# Altium schematic sheet P15_ETH3(USB)_USB 2.0 HUB.SchDoc
size 420 x 297 mm
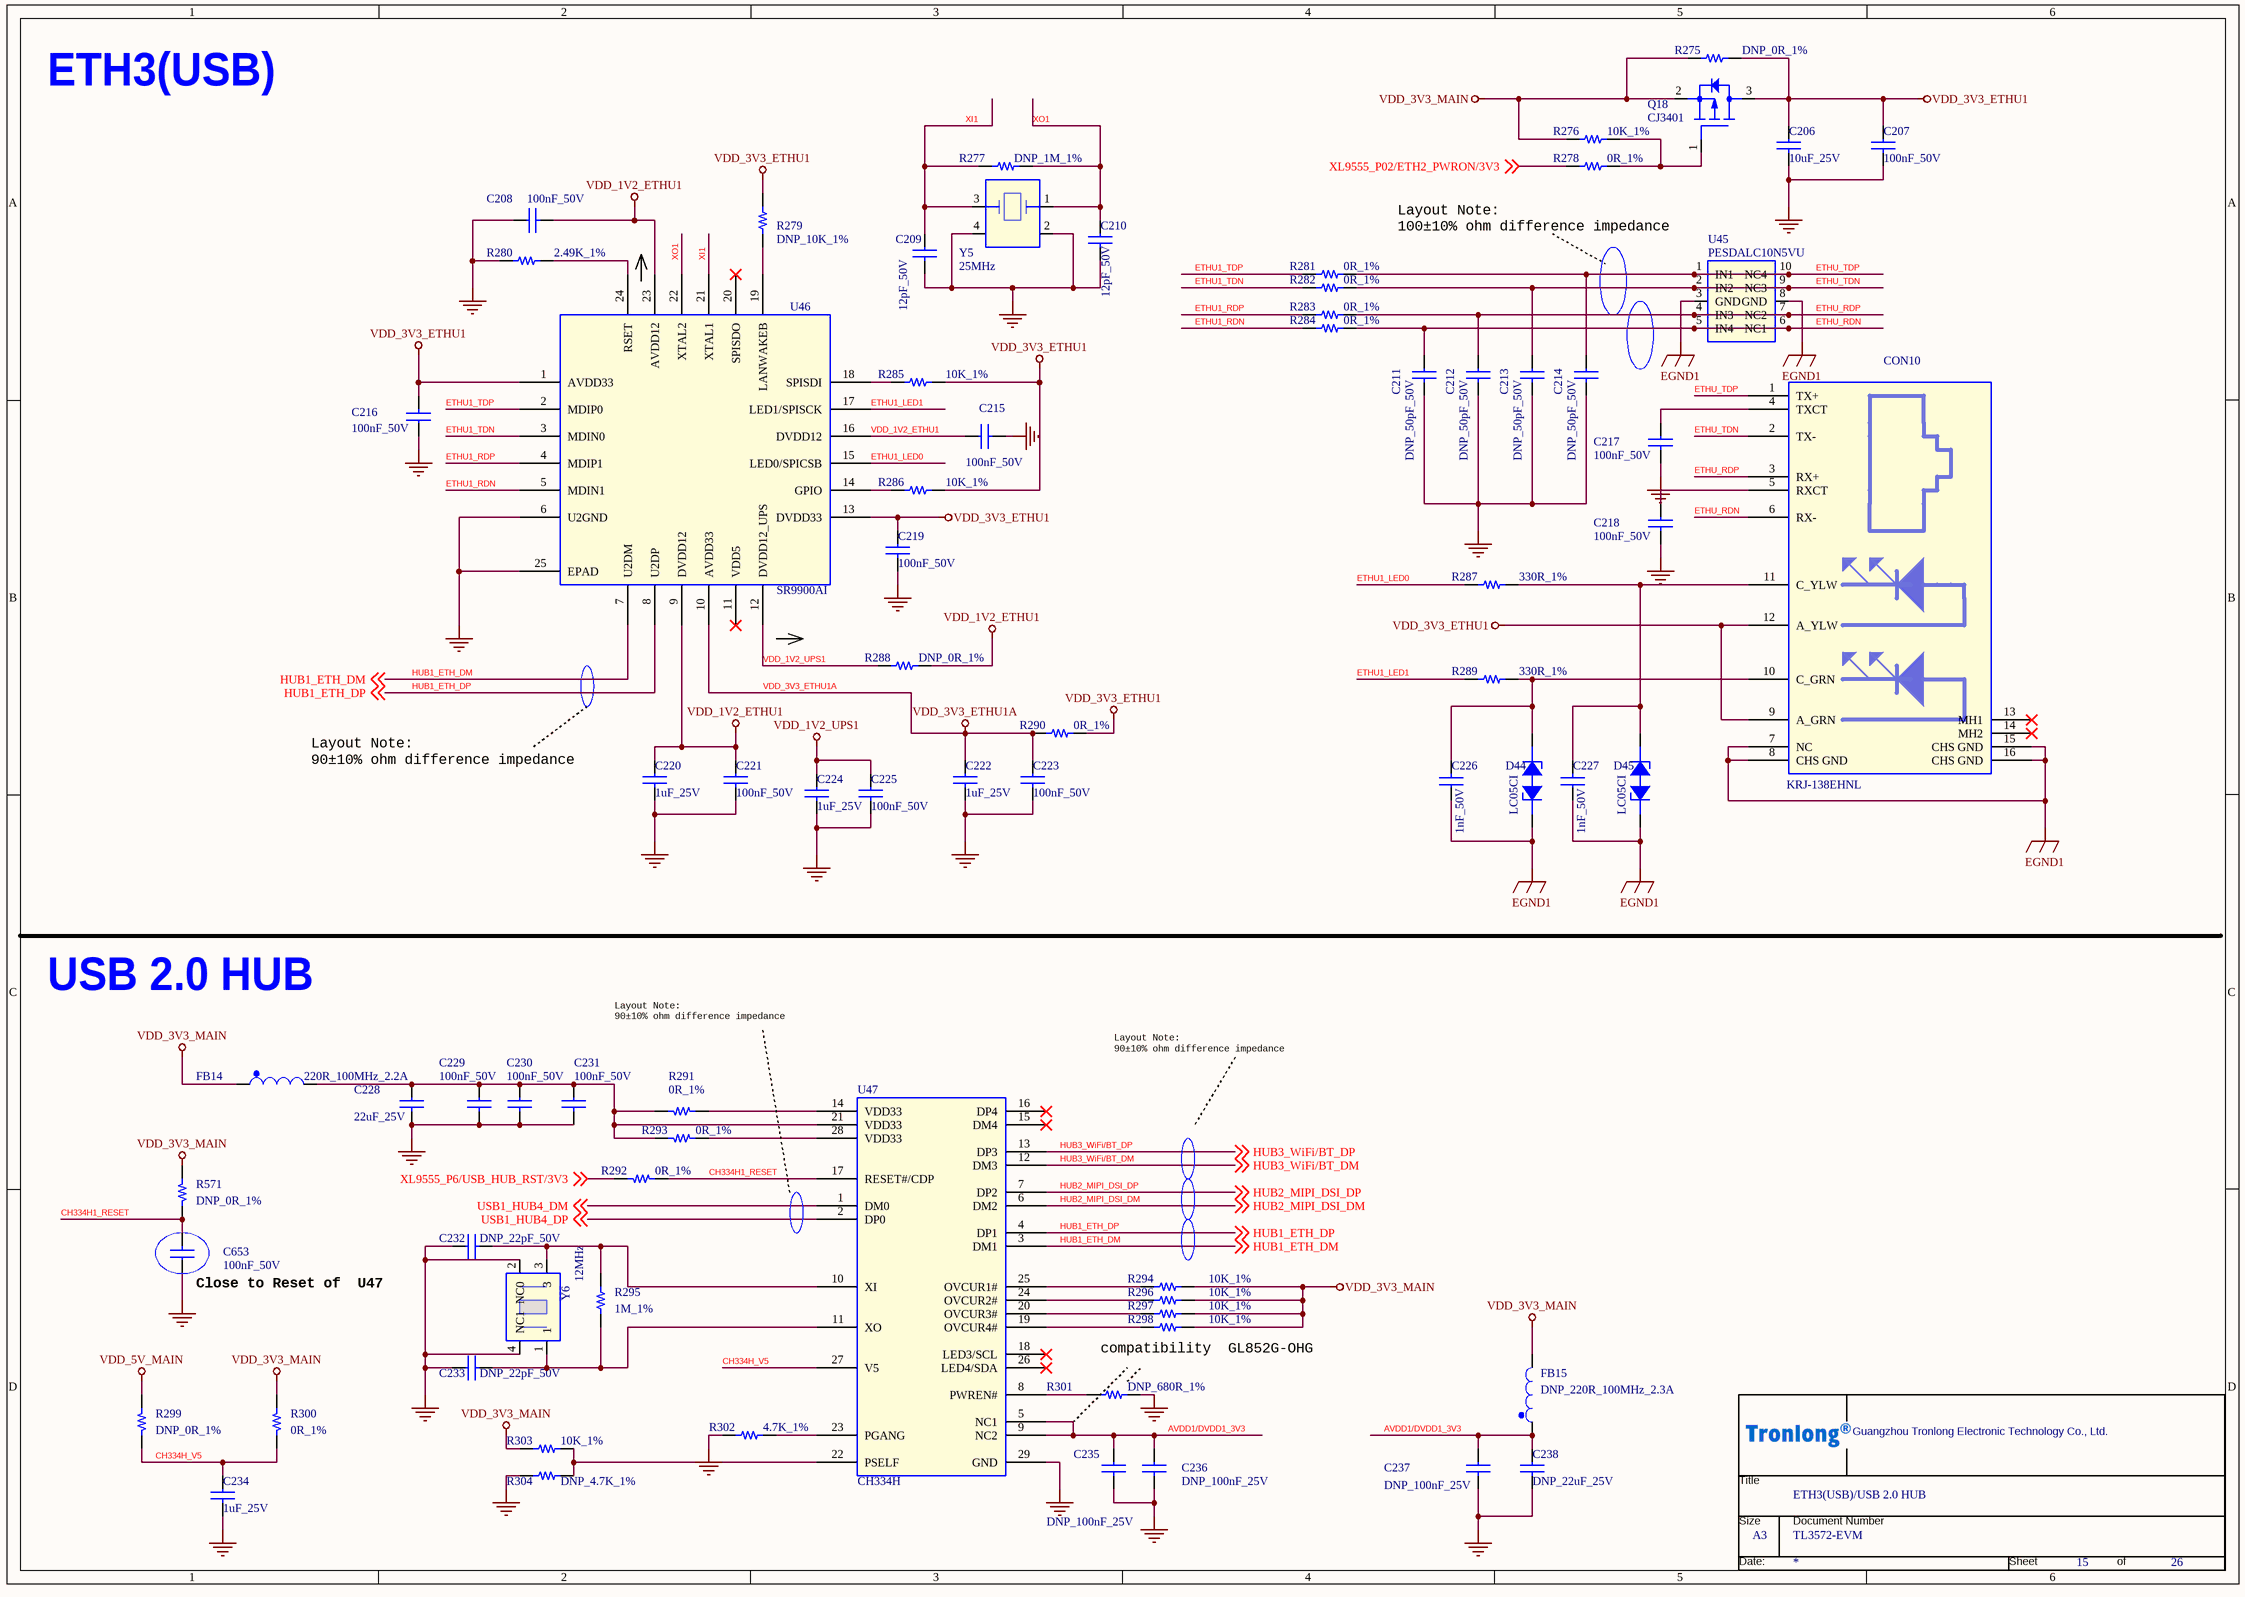
[diagram p0: P15_ETH3(USB)_USB 2.0 HUB.SchDoc]

## Parts
*  Doc: TL3572-EVM  Title: ETH3(USB)/USB 2.0 HUB  OrgName: Guangzhou Tronlong Electronic Technology Co., Ltd.  Page Size: A3  Page Number: 15  Page Count: 26  (hidden comment: Tronlong_TITTLE_20211115)  (graphical)
C206  10uF_25V  [C0603]
C207  100nF_50V  [C0402]
C208  100nF_50V  [C0402]
C209  12pF_50V  [C0402]
C210  12pF_50V  [C0402]
C211  DNP_50pF_50V  [C0402]
C212  DNP_50pF_50V  [C0402]
C213  DNP_50pF_50V  [C0402]
C214  DNP_50pF_50V  [C0402]
C215  100nF_50V  [C0402]
C216  100nF_50V  [C0402]
C217  100nF_50V  [C0402]
C218  100nF_50V  [C0402]
C219  100nF_50V  [C0402]
C220  1uF_25V  [C0402]
C221  100nF_50V  [C0402]
C222  1uF_25V  [C0402]
C223  100nF_50V  [C0402]
C224  1uF_25V  [C0402]
C225  100nF_50V  [C0402]
C226  1nF_50V  [C0402]
C227  1nF_50V  [C0402]
C228  22uF_25V  [C0805]
C229  100nF_50V  [C0402]
C230  100nF_50V  [C0402]
C231  100nF_50V  [C0402]
C232  DNP_22pF_50V  [C0603]
C233  DNP_22pF_50V  [C0603]
C234  1uF_25V  [C0402]
C235  DNP_100nF_25V  [C0402]
C236  DNP_100nF_25V  [C0402]
C237  DNP_100nF_25V  [C0402]
C238  DNP_22uF_25V  [C0805]
C653  100nF_50V  [C0402]
CON10  KRJ-138EHNL  [CON_YDS_13F-64GYD2PLXNL]
D44  LC05CI  [SOD323]
D45  LC05CI  [SOD323]
FB14  220R_100MHz_2.2A  [L0603]
FB15  DNP_220R_100MHz_2.3A  [L0603]
Q18  CJ3401  [SOT23-3]
R275  DNP_0R_1%  [R0603]
R276  10K_1%  [R0402]
R277  DNP_1M_1%  [R0603]
R278  0R_1%  [R0402]
R279  DNP_10K_1%  [R0402]
R280  2.49K_1%  [R0603]
R281  0R_1%  [R0402]
R282  0R_1%  [R0402]
R283  0R_1%  [R0402]
R284  0R_1%  [R0402]
R285  10K_1%  [R0402]
R286  10K_1%  [R0402]
R287  330R_1%  [R0402]
R288  DNP_0R_1%  [R0603]
R289  330R_1%  [R0402]
R290  0R_1%  [R0603]
R291  0R_1%  [R0402]
R292  0R_1%  [R0402]
R293  0R_1%  [R0402]
R294  10K_1%  [R0402]
R295  1M_1%  [R0402]
R296  10K_1%  [R0402]
R297  10K_1%  [R0402]
R298  10K_1%  [R0402]
R299  DNP_0R_1%  [R0402]
R300  0R_1%  [R0603]
R301  DNP_680R_1%  [R0603]
R302  4.7K_1%  [R0402]
R303  10K_1%  [R0402]
R304  DNP_4.7K_1%  [R0402]
R571  DNP_0R_1%  [R0402]
U45  PESDALC10N5VU  [DFN-10-2510]
U46  SR9900AI  [QFN24-4X4-0d5]
U47  CH334H  [QFN28_5x5]
Y5  25MHz  [SMD_3225]
Y6  12MHz  [SMD_3225]

## Nets
EGND1: C226.1 C227.1 CON10.7(NC) CON10.8(CHS_GND) CON10.15(CHS_GND) CON10.16(CHS_GND) D44.1(ANODE1) D45.1(ANODE1) U45.3(GND) U45.8(GND)
GND: C206.2 C207.2 C208.1 C209.2 C210.2 C211.2 C212.2 C213.2 C214.2 C215.2 C216.1 C217.2 C218.2 C219.2 C220.2 C221.2 C222.2 C223.2 C224.2 C225.2 C228.2 C229.2 C230.2 C231.2 C232.1 C233.1 C234.2 C235.2 C236.2 C237.2 C238.2 C653.1 R280.1 R301.2 R302.2 R304.2 U46.6(U2GND) U46.25(EPAD) U47.29(GND) Y5.2 Y5.4 Y6.2(NC0) Y6.4(NC1)
VDD_1V2_ETHU1: C208.2 C215.1 C220.1 C221.1 R288.2 U46.9(DVDD12) U46.16(DVDD12) U46.23(AVDD12)
VDD_1V2_UPS1: C224.1 C225.1 R288.1 U46.12(DVDD12_UPS)
VDD_3V3_ETHU1: C206.1 C207.1 C216.2 C219.1 CON10.9(A_GRN) CON10.12(A_YLW) Q18.3(DRAIN) R275.2 R279.2 R285.2 R286.2 R290.2 U46.1(AVDD33) U46.13(DVDD33)
VDD_3V3_ETHU1A: C222.1 C223.1 R290.1 U46.10(AVDD33)
VDD_3V3_MAIN: FB14.1 FB15.2 Q18.2(SOURCE) R275.1 R276.1 R294.2 R296.2 R297.2 R298.2 R300.2 R303.1 R571.2
VDD_5V_MAIN: R299.2
AVDD1/DVDD1_3V3: C235.1 C236.1 C237.1 C238.1 FB15.1 U47.5(NC1) U47.9(NC2)
CH334H1_RESET: C653.2 R292.1 R571.1 U47.17(RESET#/CDP)
CH334H_V5: C234.1 R299.1 R300.1 U47.27(V5)
ETHU1_LED0: R287.1 U46.15(LED0/SPICSB)
ETHU1_LED1: R289.1 U46.17(LED1/SPISCK)
ETHU1_RDN: R284.2 U46.5(MDIN1)
ETHU1_RDP: R283.2 U46.4(MDIP1)
ETHU1_TDN: R282.2 U46.3(MDIN0)
ETHU1_TDP: R281.2 U46.2(MDIP0)
ETHU_RDN: C211.1 CON10.6(RX-) R284.1 U45.5(IN4) U45.6(NC1)
ETHU_RDP: C212.1 CON10.3(RX+) R283.1 U45.4(IN3) U45.7(NC2)
ETHU_TDN: C213.1 CON10.2(TX-) R282.1 U45.2(IN2) U45.9(NC3)
ETHU_TDP: C214.1 CON10.1(TX+) R281.1 U45.1(IN1) U45.10(NC4)
HUB1_ETH_DM: U46.7(U2DM) U47.3(DM1) ; off-sheet HUB1_ETH_DM
HUB1_ETH_DP: U46.8(U2DP) U47.4(DP1) ; off-sheet HUB1_ETH_DP
HUB2_MIPI_DSI_DM: U47.6(DM2) ; off-sheet HUB2_MIPI_DSI_DM
HUB2_MIPI_DSI_DP: U47.7(DP2) ; off-sheet HUB2_MIPI_DSI_DP
HUB3_WiFi/BT_DM: U47.12(DM3) ; off-sheet HUB3_WiFi/BT_DM
HUB3_WiFi/BT_DP: U47.13(DP3) ; off-sheet HUB3_WiFi/BT_DP
USB1_HUB4_DM: U47.1(DM0) ; off-sheet USB1_HUB4_DM
USB1_HUB4_DP: U47.2(DP0) ; off-sheet USB1_HUB4_DP
XI1: C209.1 R277.2 U46.21(XTAL1) Y5.3
XL9555_P02/ETH2_PWRON/3V3: R278.2 ; off-sheet XL9555_P02/ETH2_PWRON/3V3
XL9555_P6/USB_HUB_RST/3V3: R292.2 ; off-sheet XL9555_P6/USB_HUB_RST/3V3
XO1: C210.1 R277.1 U46.22(XTAL2) Y5.1
NetC217_1: C217.1 CON10.4(TXCT)
NetC218_1: C218.1 CON10.5(RXCT)
NetC226_2: C226.2 CON10.10(C_GRN) D44.2(CATHODE2) R289.2
NetC227_2: C227.2 CON10.11(C_YLW) D45.2(CATHODE2) R287.2
NetC228_1: C228.1 C229.1 C230.1 C231.1 FB14.2 R291.1 R293.1 U47.21(VDD33)
NetC232_2: C232.2 R295.1 U47.10(XI) Y6.3
NetC233_2: C233.2 R295.2 U47.11(XO) Y6.1
NetQ18_1: Q18.1(GATE) R276.2 R278.1
NetR279_1: R279.1 U46.19(LANWAKEB)
NetR280_2: R280.2 U46.24(RSET)
NetR285_1: R285.1 U46.18(SPISDI)
NetR286_1: R286.1 U46.14(GPIO)
NetR291_2: R291.2 U47.14(VDD33)
NetR293_2: R293.2 U47.28(VDD33)
NetR294_1: R294.1 U47.25(OVCUR1#)
NetR296_1: R296.1 U47.24(OVCUR2#)
NetR297_1: R297.1 U47.20(OVCUR3#)
NetR298_1: R298.1 U47.19(OVCUR4#)
NetR301_1: R301.1 U47.8(PWREN#)
NetR302_1: R302.1 U47.23(PGANG)
NetR303_2: R303.2 R304.1 U47.22(PSELF)

Not connected (* = marked no-connect by the designer): CON10 13(MH1)* 14(MH2)*; U46 11(VDD5)* 20(SPISDO)*; U47 15(DM4)* 16(DP4)* 18(LED3/SCL)* 26(LED4/SDA)*

## Notes on the sheet
- ETH3(USB)
- Layout Note:
  100±10% ohm difference impedance
- (near C220) Layout Note:
  90±10% ohm difference impedance
- USB 2.0 HUB
- Layout Note:
  90±10% ohm difference impedance
- (near C653) Close to Reset of  U47
- (near R298) compatibility  GL852G-OHG
- (in symbol Tronlong_TITTLE_20211115) Title; Size; Document Number; Date:; Sheet; of

## Library data of the parts
* = Tronlong_TITTLE_20211115: RevCode: A?; Page Create Date: March  8, 1995; Page Modify Date: *
C206 = CAP NP_Dup2: 贴片陶瓷电容,10uF,20%,25V,X5R; Manufacturer: 广东风华高新科技股份有限公司（FH）; Manufacturer PartNumber: 0603X106M250NT; Manufacturer Character: 中国大陆; Eco-Label: ROHS; ERP Number: 005.0001.0001.00527; As-Welded: /; Operation Temperature（℃）: -55~+85(Ta); room: RGMII1; Part Status: 优选; Temperature: -55~125℃; PCB Footprint: C0603
C207 C219 C223 = CAP NP_Dup2: 贴片陶瓷电容,100nF,10%,50V,X7R; Manufacturer Character: 中国大陆; Manufacturer: 广东风华高新科技股份有限公司（FH）; Manufacturer PartNumber: 0402B104K500NT; As-Welded: /; room: RGMII1; Operation Temperature（℃）: -55~+125(Ta); ERP Number: 005.0001.0001.00681; Eco-Label: ROHS; Temperature: -55~125℃; Part Status: 试用; PCB Footprint: C0402
C208 C216 = CAP NP_Dup2: 贴片陶瓷电容,100nF,10%,50V,X7R; Manufacturer Character: 中国大陆; Manufacturer: 广东风华高新科技股份有限公司（FH）; Manufacturer PartNumber: 0402B104K500NT; Eco-Label: ROHS; ERP Number: 005.0001.0001.00681; room: RGMII1; Operation Temperature（℃）: -55~+125(Ta); As-Welded: /; Part Status: 试用; Temperature: -55~125℃; PCB Footprint: C0402
C209 = CAP NP_Dup2: 贴片陶瓷电容,12pF,5%,50V,COG; Manufacturer Character: 中国大陆; Manufacturer: 广东风华高新科技股份有限公司（FH）; Manufacturer PartNumber: 0402CG120J500NT; ERP Number: 005.0001.0001.00612; As-Welded: /; room: RGMII1; Operation Temperature（℃）: -55~+125(Ta); Eco-Label: ROHS; Part Status: 试用; Temperature: -55~125℃; PCB Footprint: C0402
C210 = CAP NP_Dup2: 贴片陶瓷电容,12pF,5%,50V,COG; Manufacturer Character: 中国大陆; Manufacturer PartNumber: 0402CG120J500NT; Manufacturer: 广东风华高新科技股份有限公司（FH）; ERP Number: 005.0001.0001.00612; As-Welded: /; room: RGMII1; Operation Temperature（℃）: -55~+125(Ta); Eco-Label: ROHS; Part Status: 试用; Temperature: -55~125℃; PCB Footprint: C0402
C211-C214 = CAP NP_Dup2: 贴片陶瓷电容,100nF,10%,50V,X7R; Manufacturer Character: 中国大陆; Manufacturer: 广东风华高新科技股份有限公司（FH）; Manufacturer PartNumber: 0402B104K500NT; As-Welded: DNP; room: 6; Operation Temperature（℃）: -55~+125(Ta); ERP Number: 005.0001.0001.00681; Eco-Label: ROHS; Temperature: -55~125℃; Part Status: 试用; PCB Footprint: C0402
C215 C225 = CAP NP_Dup2: 贴片陶瓷电容,100nF,10%,50V,X7R; Manufacturer Character: 中国大陆; Manufacturer PartNumber: 0402B104K500NT; Manufacturer: 广东风华高新科技股份有限公司（FH）; As-Welded: /; room: RGMII1; Operation Temperature（℃）: -55~+125(Ta); ERP Number: 005.0001.0001.00681; Eco-Label: ROHS; Part Status: 试用; Temperature: -55~125℃; PCB Footprint: C0402
C217 = CAP NP_Dup2: 贴片陶瓷电容,100nF,10%,50V,X7R; Manufacturer Character: 中国大陆; Manufacturer: 广东风华高新科技股份有限公司（FH）; Manufacturer PartNumber: 0402B104K500NT; As-Welded: /; room: 6; Operation Temperature（℃）: -55~+125(Ta); ERP Number: 005.0001.0001.00681; Eco-Label: ROHS; Temperature: -55~125℃; Part Status: 试用; PCB Footprint: C0402
C218 = CAP NP_Dup2: 贴片陶瓷电容,100nF,10%,50V,X7R; Manufacturer PartNumber: 0402B104K500NT; Manufacturer: 广东风华高新科技股份有限公司（FH）; Manufacturer Character: 中国大陆; As-Welded: /; Operation Temperature（℃）: -55~+125(Ta); room: 6; ERP Number: 005.0001.0001.00681; Eco-Label: ROHS; Temperature: -55~125℃; Part Status: 试用; PCB Footprint: C0402
C220 C224 = CAP NP_Dup2: 贴片陶瓷电容,1uF,10%,25V,X5R; Manufacturer Character: 中国大陆; Manufacturer: 广东风华高新科技股份有限公司（FH）; Manufacturer PartNumber: 0402X105K250NT; Eco-Label: ROHS; ERP Number: 005.0001.0001.00640; Operation Temperature（℃）: -55~+85(Ta); room: RGMII1; As-Welded: /; Part Status: 试用; PCB Footprint: C0402
C221 = CAP NP_Dup2: 贴片陶瓷电容,100nF,10%,50V,X7R; Manufacturer PartNumber: 0402B104K500NT; Manufacturer: 广东风华高新科技股份有限公司（FH）; Manufacturer Character: 中国大陆; As-Welded: /; Operation Temperature（℃）: -55~+125(Ta); room: RGMII1; ERP Number: 005.0001.0001.00681; Eco-Label: ROHS; Part Status: 试用; Temperature: -55~125℃; PCB Footprint: C0402
C222 = CAP NP_Dup2: 贴片陶瓷电容,1uF,10%,25V,X5R; Manufacturer: 广东风华高新科技股份有限公司（FH）; Manufacturer PartNumber: 0402X105K250NT; Manufacturer Character: 中国大陆; Eco-Label: ROHS; ERP Number: 005.0001.0001.00640; room: RGMII1; Operation Temperature（℃）: -55~+85(Ta); As-Welded: /; Part Status: 试用; PCB Footprint: C0402
C226 = CAP NP_1: 贴片陶瓷电容,1nF,10%,50V,X7R; Manufacturer: 广东风华高新科技股份有限公司（FH）; Manufacturer PN: GRM033R61E102KA01; Manufacturer Character: 中国大陆; Manufacturer PartNumber: 0402B102K500NT; ERP Number: 005.0001.0001.00523; RK PN: 902003109; Priority: A; Operation Temperature（℃）: -55~+125(Ta); As-Welded: /; Eco-Label: ROHS; Part Type: 一般用片状陶瓷电容; Tolerance: ±10%; Created by: JJJ; Part Status: 优选
C227 = CAP NP_1: 贴片陶瓷电容,1nF,10%,50V,X7R; Manufacturer PartNumber: 0402B102K500NT; Manufacturer Character: 中国大陆; Manufacturer PN: GRM033R61E102KA01; Manufacturer: 广东风华高新科技股份有限公司（FH）; As-Welded: /; Operation Temperature（℃）: -55~+125(Ta); Priority: A; RK PN: 902003109; ERP Number: 005.0001.0001.00523; Eco-Label: ROHS; Created by: JJJ; Tolerance: ±10%; Part Type: 一般用片状陶瓷电容; Part Status: 优选
C228 = CAP NP_Dup2: 贴片陶瓷电容,22uF,20%,25V,X5R; Manufacturer Character: 中国大陆; Manufacturer PartNumber: 0805X226M250NT; Manufacturer: 广东风华高新科技股份有限公司（FH）; room: USB HUB; Operation Temperature（℃）: -55~+85(Ta); As-Welded: /; ERP Number: 005.0001.0001.00524; Eco-Label: ROHS; Temperature: -55~125℃; Part Status: 优选; PCB Footprint: C0805
C229 C231 = CAP NP_Dup2: 贴片陶瓷电容,100nF,10%,50V,X7R; Manufacturer PartNumber: 0402B104K500NT; Manufacturer: 广东风华高新科技股份有限公司（FH）; Manufacturer Character: 中国大陆; As-Welded: /; Operation Temperature（℃）: -55~+125(Ta); room: USB HUB; ERP Number: 005.0001.0001.00681; Eco-Label: ROHS; Temperature: -55~125℃; Part Status: 试用; PCB Footprint: C0402
C230 = CAP NP_Dup2: 贴片陶瓷电容,100nF,10%,50V,X7R; Manufacturer Character: 中国大陆; Manufacturer PartNumber: 0402B104K500NT; Manufacturer: 广东风华高新科技股份有限公司（FH）; As-Welded: /; room: USB HUB; Operation Temperature（℃）: -55~+125(Ta); ERP Number: 005.0001.0001.00681; Eco-Label: ROHS; Temperature: -55~125℃; Part Status: 试用; PCB Footprint: C0402
C232 = CAP NP_Dup2: 贴片陶瓷电容,22pF,5%,50V,COG; Manufacturer PartNumber: 0603CG220J500NT; Manufacturer: 广东风华高新科技股份有限公司（FH）; Manufacturer Character: 中国大陆; Eco-Label: EXEMPTION; ERP Number: 005.0001.0001.00542; Operation Temperature（℃）: -55~+125(Ta); As-Welded: DNP; room: USB HUB; Part Status: 优选; Temperature: -55~125℃; PCB Footprint: C0603
C233 = CAP NP_Dup2: 贴片陶瓷电容,22pF,5%,50V,COG; Manufacturer: 广东风华高新科技股份有限公司（FH）; Manufacturer PartNumber: 0603CG220J500NT; Manufacturer Character: 中国大陆; Eco-Label: EXEMPTION; ERP Number: 005.0001.0001.00542; Operation Temperature（℃）: -55~+125(Ta); As-Welded: DNP; room: USB HUB; Part Status: 优选; Temperature: -55~125℃; PCB Footprint: C0603
C234 = CAP NP_Dup2: 贴片陶瓷电容,1uF,10%,25V,X5R; Manufacturer: 广东风华高新科技股份有限公司（FH）; Manufacturer PartNumber: 0402X105K250NT; Manufacturer Character: 中国大陆; Eco-Label: ROHS; ERP Number: 005.0001.0001.00640; room: USB HUB; Operation Temperature（℃）: -55~+85(Ta); As-Welded: /; PCB Footprint: C0402; Part Status: 试用
C235 = CAP NP_Dup2: 贴片陶瓷电容,100nF,10%,25V,X7R; Manufacturer Character: 中国大陆; Manufacturer PartNumber: 0402B104K250NT; Manufacturer: 广东风华高新科技股份有限公司（FH）; room: USB HUB; As-Welded: DNP; Operation Temperature（℃）: -55~+125(Ta); ERP Number: 005.0001.0001.00518; Eco-Label: ROHS; Part Status: 优选; Temperature: -55~125℃; PCB Footprint: C0402
C236 = CAP NP_Dup2: 贴片陶瓷电容,100nF,10%,25V,X7R; Manufacturer Character: 中国大陆; Manufacturer PartNumber: 0402B104K250NT; Manufacturer: 广东风华高新科技股份有限公司（FH）; Eco-Label: ROHS; ERP Number: 005.0001.0001.00518; room: USB HUB; As-Welded: DNP; Operation Temperature（℃）: -55~+125(Ta); Part Status: 优选; Temperature: -55~125℃; PCB Footprint: C0402
C237 = CAP NP_Dup2: 贴片陶瓷电容,100nF,10%,25V,X7R; Manufacturer: 广东风华高新科技股份有限公司（FH）; Manufacturer PartNumber: 0402B104K250NT; Manufacturer Character: 中国大陆; Eco-Label: ROHS; ERP Number: 005.0001.0001.00518; Operation Temperature（℃）: -55~+125(Ta); As-Welded: DNP; room: USB HUB; Part Status: 优选; Temperature: -55~125℃; PCB Footprint: C0402
C238 = CAP NP_Dup2: CL21A226MAQNNNE，CL21A226MAYNNNE; Manufacturer PartNumber: 22uF,20%,C0805,25V,（X7R,X5R,COG,NPO或X7S）; Manufacturer: 广州创龙; Operation Temperature（℃）: -40~+85(Ta); As-Welded: DNP; room: USB HUB; ERP Number: 005.0001.0022.00185; Eco-Label: ROHS; Part Status: -; Temperature: -55~125℃; Manufacturer Character: -; PCB Footprint: C0805
C653 = CAP NP_Dup2: 贴片陶瓷电容,100nF,10%,50V,X7R; Manufacturer: 广东风华高新科技股份有限公司（FH）; Manufacturer PartNumber: 0402B104K500NT; Manufacturer Character: 中国大陆; Eco-Label: ROHS; Operation Temperature（℃）: -55~+125(Ta); room: USB HUB; As-Welded: /; ERP Number: 005.0001.0001.00681; Temperature: -55~125℃; Part Status: 试用; PCB Footprint: C0402
CON10 = ETHERNET CONNECTER: RJ45连接器,12P,2.54mm间距,单层母座,90度,插件; Manufacturer Character: 中国大陆; Manufacturer: 东莞市科优达电子科技有限公司（DGKYD）; room: ecat1; Operation Temperature（℃）: -40~+85(Ta); As-Welded: /; ERP Number: 005.0001.0003.00314; Eco-Label: ROHS; Manufacturer PartNumber: KRJ-138EHNL; Manufacturer Part Number: KRJ-138EHNL; Temperature: -40~85℃; Part Status: 优选; PCB Footprint: CON_YDS_13F-64GYD2PLXNL
D44 D45 = DIODE BREAKDOWN_2: TVS二极管,VRWM=5V,VBR=6V,一组,双向,30KV,30KV; Manufacturer Character: 中国大陆; Manufacturer: 上海雷卯电子科技有限公司（Leiditech）; Manufacturer Part Number: PESD3V3L1BA; Eco-Label: ROHS; ERP Number: 005.0001.0017.00060; room: KEY; Operation Temperature（℃）: -55~+125(Tj); As-Welded: /; Manufacturer PartNumber: LC05CI; Temperature: -55~155℃; Part Status: 优选; PCB Footprint: SOD323
FB14 = FERRITE BEAD: 磁珠,50mΩ,2.2A,220R@100MHz; Manufacturer PartNumber: UPZ1608U221-2R2TF; Manufacturer: 深圳顺络电子股份有限公司（Sunlord）; Manufacturer Character: 中国大陆; Eco-Label: ROHS; ERP Number: 005.0001.0007.00015; As-Welded: /; Operation Temperature（℃）: -55~+125(Ta); room: USB HUB; Temperature: -55~+125(Ta); Part Status: 限选; PCB Footprint: L0603
FB15 = FERRITE BEAD: 磁珠,50mΩ,2.3A,220R@100MHz; Manufacturer PartNumber: UPZ1608U221-2R3TF; Manufacturer: 深圳顺络电子股份有限公司（Sunlord）; Manufacturer Character: 中国大陆; Operation Temperature（℃）: -55~+125(Ta); As-Welded: DNP; room: USB HUB; ERP Number: 005.0001.0007.00023; Eco-Label: ROHS; Temperature: -55~125℃; Part Status: 测评; PCB Footprint: L0603
Q18 = MOSFET P SOT: MOSFET,P沟道,VDSS=-30V,VGSS=±12V,ID=-4.2A,PD=0.35W,VGS(th)=-1.3V; Manufacturer Character: 中国大陆; Manufacturer: 江苏长晶科技股份有限公司（JSCJ）; Eco-Label: ROHS; ERP Number: 005.0001.0009.00015; As-Welded: /; Operation Temperature（℃）: -55~+150(Tj); room: DCIN; Manufacturer PartNumber: CJ3401; Manufacturer Part Number: CJ3401; Temperature: -55~150℃; Part Status: 优选; PCB Footprint: SOT23-3
R275 = Resistor_Dup3: 贴片电阻,0R,±1%,1/10W; Manufacturer Character: 中国大陆; Manufacturer PartNumber: RS-03000FT; Manufacturer: 广东风华高新科技股份有限公司（FH）; CLASS: DISCRETE; As-Welded: DNP; room: RGMII1; Operation Temperature（℃）: -55~+155(Ta); ERP Number: 005.0001.0002.00956; Eco-Label: ROHS; Part Status: 优选; Temperature: -55~125℃; PCB Footprint: R0603
R276 = Resistor_Dup3: 贴片电阻,10K,±1%,1/16W; Manufacturer: 广东风华高新科技股份有限公司（FH）; Manufacturer PartNumber: RC-02K1002FT; Manufacturer Character: 中国大陆; CLASS: DISCRETE; Eco-Label: ROHS; ERP Number: 005.0001.0002.01326; As-Welded: /; Operation Temperature（℃）: -55~+125(Ta); Temperature: –55~155℃; Part Status: 优选; PCB Footprint: R0402
R277 = Resistor_Dup3: 0603WAF1004T5E,RC0603FR-071ML; Manufacturer: 广州创龙; Manufacturer PartNumber: 1M,±1%,R0603,≥1/10W; CLASS: DISCRETE; room: RGMII1; As-Welded: DNP; Operation Temperature（℃）: -40~+85(Ta); ERP Number: 005.0001.0023.00339; Eco-Label: ROHS; Part Status: -; Manufacturer Character: -; PCB Footprint: R0603
R278 = Resistor_Dup3: 贴片电阻,0R,±1%,1/16W; Manufacturer Character: 中国大陆; Manufacturer PartNumber: RC-02000FT; Manufacturer: 广东风华高新科技股份有限公司（FH）; CLASS: DISCRETE; Eco-Label: ROHS; ERP Number: 005.0001.0002.00938; Operation Temperature（℃）: -55~+155(Ta); As-Welded: /; Part Status: 优选; PCB Footprint: R0402
R279 = Resistor_Dup3: 贴片电阻,10K,±1%,1/16W; Manufacturer PartNumber: RC-02K1002FT; Manufacturer: 广东风华高新科技股份有限公司（FH）; Manufacturer Character: 中国大陆; CLASS: DISCRETE; Operation Temperature（℃）: -55~+125(Ta); As-Welded: DNP; room: RGMII1; ERP Number: 005.0001.0002.01326; Eco-Label: ROHS; Part Status: 优选; Temperature: -55~125℃; PCB Footprint: R0402
R280 = Resistor_Dup3: 贴片电阻,2.49K,±1%,1/10W; Manufacturer PartNumber: RS-03K2491FT; Manufacturer: 广东风华高新科技股份有限公司（FH）; Manufacturer Character: 中国大陆; CLASS: DISCRETE; Eco-Label: ROHS; ERP Number: 005.0001.0002.00969; Operation Temperature（℃）: -55~+155(Ta); room: RGMII1; As-Welded: /; Part Status: 优选; PCB Footprint: R0603
R281-R284 R292 = Resistor_Dup3: 贴片电阻,0R,±1%,1/16W; Manufacturer: 广东风华高新科技股份有限公司（FH）; Manufacturer PartNumber: RC-02000FT; Manufacturer Character: 中国大陆; CLASS: DISCRETE; Eco-Label: ROHS; ERP Number: 005.0001.0002.00938; Operation Temperature（℃）: -55~+155(Ta); As-Welded: /; Part Status: 优选; PCB Footprint: R0402
R285 = Resistor_Dup3: 贴片电阻,10K,±1%,1/16W; Manufacturer: 广东风华高新科技股份有限公司（FH）; Manufacturer PartNumber: RC-02K1002FT; Manufacturer Character: 中国大陆; CLASS: DISCRETE; Operation Temperature（℃）: -55~+125(Ta); room: RGMII1; As-Welded: /; ERP Number: 005.0001.0002.01326; Eco-Label: ROHS; Temperature: -55~125℃; Part Status: 优选; PCB Footprint: R0402
R286 = Resistor_Dup3: 贴片电阻,10K,±1%,1/16W; Manufacturer Character: 中国大陆; Manufacturer PartNumber: RC-02K1002FT; Manufacturer: 广东风华高新科技股份有限公司（FH）; CLASS: DISCRETE; Eco-Label: ROHS; ERP Number: 005.0001.0002.01326; As-Welded: /; room: RGMII1; Operation Temperature（℃）: -55~+125(Ta); Part Status: 优选; Temperature: -55~125℃; PCB Footprint: R0402
R287 = Resistor_Dup3: RC0402FR-07330RL,0402WGF3300TCE; Manufacturer PartNumber: 330R,±1%,R0402,≥1/16W; Manufacturer: 广州创龙; CLASS: DISCRETE; As-Welded: /; Operation Temperature（℃）: -40~+85(Ta); room: ecat1; ERP Number: 005.0001.0023.00144; Eco-Label: ROHS; Part Status: -; Temperature: –55~155℃; Manufacturer Character: -; PCB Footprint: R0402
R288 = Resistor_Dup3: 贴片电阻,0R,±1%,1/10W; Manufacturer Character: 中国大陆; Manufacturer PartNumber: RS-03000FT; Manufacturer: 广东风华高新科技股份有限公司（FH）; CLASS: DISCRETE; Eco-Label: ROHS; ERP Number: 005.0001.0002.00956; room: RGMII1; As-Welded: DNP; Operation Temperature（℃）: -55~+155(Ta); Temperature: -55~125℃; Part Status: 优选; PCB Footprint: R0603
R289 = Resistor_Dup3: RC0402FR-07330RL,0402WGF3300TCE; Manufacturer: 广州创龙; Manufacturer PartNumber: 330R,±1%,R0402,≥1/16W; CLASS: DISCRETE; As-Welded: /; Operation Temperature（℃）: -40~+85(Ta); room: ecat1; ERP Number: 005.0001.0023.00144; Eco-Label: ROHS; Part Status: -; Temperature: –55~155℃; Manufacturer Character: -; PCB Footprint: R0402
R290 = Resistor_Dup3: 贴片电阻,0R,±1%,1/10W; Manufacturer Character: 中国大陆; Manufacturer: 广东风华高新科技股份有限公司（FH）; Manufacturer PartNumber: RS-03000FT; CLASS: DISCRETE; Eco-Label: ROHS; ERP Number: 005.0001.0002.00956; As-Welded: /; Operation Temperature（℃）: -55~+155(Ta); room: RGMII1; Part Status: 优选; PCB Footprint: R0603
R291 R293 = Resistor_Dup3: 贴片电阻,0R,±1%,1/16W; Manufacturer Character: 中国大陆; Manufacturer: 广东风华高新科技股份有限公司（FH）; Manufacturer PartNumber: RC-02000FT; CLASS: DISCRETE; As-Welded: /; Operation Temperature（℃）: -55~+155(Ta); ERP Number: 005.0001.0002.00938; Eco-Label: ROHS; Part Status: 优选; PCB Footprint: R0402
R294 = Resistor_Dup3: 贴片电阻,10K,±1%,1/16W; Manufacturer Character: 中国大陆; Manufacturer: 广东风华高新科技股份有限公司（FH）; Manufacturer PartNumber: RC-02K1002FT; CLASS: DISCRETE; Eco-Label: ROHS; ERP Number: 005.0001.0002.01326; As-Welded: /; room: USB HUB; Operation Temperature（℃）: -55~+125(Ta); Temperature: –55~155℃; Part Status: 优选; PCB Footprint: R0402
R295 = Resistor_Dup3: RC0402FR-071ML,0402WGF1004TCE; Manufacturer PartNumber: 1M,±1%,R0402,≥1/16W; Manufacturer: 广州创龙; CLASS: DISCRETE; As-Welded: /; Operation Temperature（℃）: -40~+85(Ta); room: USB HUB; ERP Number: 005.0001.0023.00078; Eco-Label: ROHS; Part Status: -; Manufacturer Character: -; PCB Footprint: R0402
R296 R298 R303 = Resistor_Dup3: 贴片电阻,10K,±1%,1/16W; Manufacturer: 广东风华高新科技股份有限公司（FH）; Manufacturer PartNumber: RC-02K1002FT; Manufacturer Character: 中国大陆; CLASS: DISCRETE; Operation Temperature（℃）: -55~+125(Ta); room: USB HUB; As-Welded: /; ERP Number: 005.0001.0002.01326; Eco-Label: ROHS; Temperature: –55~155℃; Part Status: 优选; PCB Footprint: R0402
R297 = Resistor_Dup3: 贴片电阻,10K,±1%,1/16W; Manufacturer PartNumber: RC-02K1002FT; Manufacturer: 广东风华高新科技股份有限公司（FH）; Manufacturer Character: 中国大陆; CLASS: DISCRETE; Operation Temperature（℃）: -55~+125(Ta); room: USB HUB; As-Welded: /; ERP Number: 005.0001.0002.01326; Eco-Label: ROHS; Temperature: –55~155℃; Part Status: 优选; PCB Footprint: R0402
R299 = Resistor_Dup3: 贴片电阻,0R,±1%,1/16W; Manufacturer: 广东风华高新科技股份有限公司（FH）; Manufacturer PartNumber: RC-02000FT; Manufacturer Character: 中国大陆; CLASS: DISCRETE; Eco-Label: ROHS; ERP Number: 005.0001.0002.00938; As-Welded: DNP; Operation Temperature（℃）: -55~+155(Ta); PCB Footprint: R0402; Part Status: 优选
R300 = Resistor_Dup3: 贴片电阻,0R,±1%,1/10W; Manufacturer Character: 中国大陆; Manufacturer PartNumber: RS-03000FT; Manufacturer: 广东风华高新科技股份有限公司（FH）; CLASS: DISCRETE; As-Welded: /; Operation Temperature（℃）: -55~+155(Ta); ERP Number: 005.0001.0002.00956; Eco-Label: ROHS; Temperature: –55~155℃; Part Status: 优选; PCB Footprint: R0603
R301 = Resistor_Dup3: 贴片电阻,680R,±1%,1/10W; Manufacturer Character: 中国大陆; Manufacturer: 广东风华高新科技股份有限公司（FH）; Manufacturer PartNumber: RS-03K6800FT; CLASS: DISCRETE; Eco-Label: ROHS; ERP Number: 005.0001.0002.01053; room: USB HUB; As-Welded: DNP; Operation Temperature（℃）: -55~+155(Ta); PCB Footprint: R0603; Temperature: -55~155℃; Part Status: 优选
R302 = Resistor_Dup3: 贴片电阻,4.7K,±1%,1/16W; Manufacturer PartNumber: RC-02K4701FT; Manufacturer: 广东风华高新科技股份有限公司（FH）; Manufacturer Character: 中国大陆; CLASS: DISCRETE; Eco-Label: ROHS; ERP Number: 005.0001.0002.01359; Operation Temperature（℃）: -55~+125(Ta); As-Welded: /; Temperature: -55~155℃; Part Status: 试用; PCB Footprint: R0402
R304 = Resistor_Dup3: RC0402FR-074K7L,0402WGF4701TCE; Manufacturer: 广州创龙; Manufacturer PartNumber: 4.7K,±1%,R0402,≥1/16W; CLASS: DISCRETE; ERP Number: 005.0001.0023.00160; As-Welded: DNP; Operation Temperature（℃）: -40~+85(Ta); Eco-Label: ROHS; PCB Footprint: R0402; Temperature: -55~155℃; Manufacturer Character: -; Part Status: -
R571 = Resistor_Dup3: 贴片电阻,0R,±1%,1/16W; Manufacturer Character: 中国大陆; Manufacturer PartNumber: RC-02000FT; Manufacturer: 广东风华高新科技股份有限公司（FH）; CLASS: DISCRETE; Eco-Label: ROHS; ERP Number: 005.0001.0002.00938; Operation Temperature（℃）: -55~+155(Ta); As-Welded: DNP; PCB Footprint: R0402; Part Status: 优选
U45 = SU099PGTR: ESD二极管,VRWM=5V,VBR=6V,四组,单向,15KV,30KV; Manufacturer: 上海芯导电子科技股份有限公司（Prisemi）; Manufacturer Character: 中国大陆; Operation Temperature（℃）: -55~+150(Tj); As-Welded: /; ERP Number: 005.0001.0004.00739; Eco-Label: ROHS; Part Status: 优选; Manufacturer PartNumber: PESDALC10N5VU; Temperature: -40~85℃; PCB Footprint: DFN-10-2510
U46 = SR9900_1: 以太网控制器，USB; Manufacturer Character: 中国大陆; Manufacturer: 深圳市和芯润德科技有限公司（CoreChips）; Operation Temperature（℃）: -40~+85(Ta); As-Welded: /; ERP Number: 005.0001.0004.00914; Eco-Label: ROHS; Part Status: 试用; Manufacturer PartNumber: SR9900AI; PCB Footprint: QFN24-4X4-0d5
U47 = GL852GT_1: USB HUB控制器; Manufacturer: 南京沁恒微电子股份有限公司（WCH）; Manufacturer Character: 中国大陆; Operation Temperature（℃）: -40~+85(Ta); room: USB HUB; As-Welded: /; ERP Number: 005.0001.0004.00915; Eco-Label: ROHS; PCB Footprint: QFN28_5x5; Temperature: -40~85℃; Manufacturer PartNumber: CH334H; Part Status: 优选
Y5 = CRYSTAL SMD 4PIN: 四脚无源晶振,25MHz,±10ppm,12pF,30Ω,±30ppm; Manufacturer Character: 中国大陆; Manufacturer PartNumber: S3B25.000F1210F30; Manufacturer: 深圳市星通时频电子有限公司（SCTF）; room: RGMII1; Operation Temperature（℃）: -40~+85(Ta); As-Welded: /; ERP Number: 005.0001.0005.00124; Eco-Label: ROHS; PCB Footprint: SMD_3225; Part Status: 试用; Temperature: -55~150℃
Y6 = CRYSTAL: 四脚无源晶振,12MHz,±10ppm,12pF,100Ω,±30ppm; Manufacturer Character: 中国大陆; Manufacturer PartNumber: S3B12.000F1210F30; Manufacturer: 深圳市星通时频电子有限公司（SCTF）; Eco-Label: ROHS; ERP Number: 005.0001.0005.00120; As-Welded: /; room: USB HUB; Operation Temperature（℃）: -40~+85(Ta); PCB Footprint: SMD_3225; Temperature: -40~85℃; Part Status: 试用